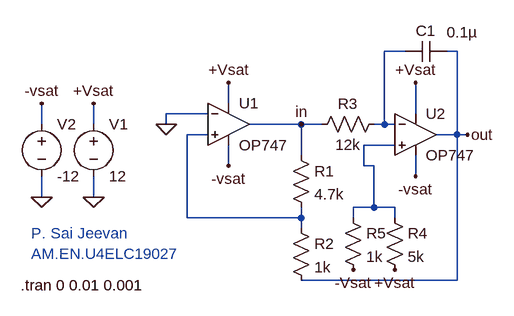
[diagram p0: schematic Sawtooth Waveform Generator.asc]
Sawtooth Waveform Generator.asc, the LTspice schematic file:
Version 4
SHEET 1 880 680
WIRE 352 32 320 32
WIRE 432 32 416 32
WIRE 80 112 80 80
WIRE 48 128 -16 128
WIRE 368 128 368 80
WIRE -208 144 -208 112
WIRE -128 144 -128 112
WIRE -16 144 -16 128
WIRE 192 144 112 144
WIRE 224 144 192 144
WIRE 320 144 320 32
WIRE 320 144 304 144
WIRE 336 144 320 144
WIRE 48 160 16 160
WIRE 432 160 432 32
WIRE 432 160 400 160
WIRE 448 160 432 160
WIRE 336 176 288 176
WIRE 192 192 192 144
WIRE 80 208 80 176
WIRE 288 208 288 176
WIRE 304 208 288 208
WIRE 368 224 368 192
WIRE -208 256 -208 224
WIRE -128 256 -128 224
WIRE 304 272 304 208
WIRE 304 272 272 272
WIRE 336 272 304 272
WIRE 16 288 16 160
WIRE 192 288 192 272
WIRE 192 288 16 288
WIRE 272 288 272 272
WIRE 336 288 336 272
WIRE 192 304 192 288
WIRE 432 384 432 160
WIRE 432 384 192 384
FLAG -16 144 0
FLAG 448 160 out
FLAG 80 80 +Vsat
FLAG 368 80 +Vsat
FLAG 368 224 -vsat
FLAG 80 208 -vsat
FLAG -128 256 0
FLAG -208 256 0
FLAG -128 112 +Vsat
FLAG -208 112 -vsat
FLAG 192 144 in
FLAG 336 368 +Vsat
FLAG 272 368 -Vsat
SYMBOL Opamps\\OP747 80 80 R0
SYMATTR InstName U1
SYMBOL Opamps\\OP747 368 96 R0
SYMATTR InstName U2
SYMBOL res 176 176 R0
SYMATTR InstName R1
SYMATTR Value 4.7k
SYMBOL res 176 288 R0
SYMATTR InstName R2
SYMATTR Value 1k
SYMBOL res 320 128 R90
WINDOW 0 0 56 VBottom 2
WINDOW 3 32 56 VTop 2
SYMATTR InstName R3
SYMATTR Value 12k
SYMBOL cap 416 16 R90
WINDOW 0 0 32 VBottom 2
WINDOW 3 -29 -24 VTop 2
SYMATTR InstName C1
SYMATTR Value 0.1µ
SYMBOL voltage -128 128 R0
WINDOW 123 0 0 Left 0
WINDOW 39 0 0 Left 0
SYMATTR InstName V1
SYMATTR Value 12
SYMBOL voltage -208 128 R0
WINDOW 123 0 0 Left 0
WINDOW 39 0 0 Left 0
SYMATTR InstName V2
SYMATTR Value -12
SYMBOL res 320 272 R0
SYMATTR InstName R4
SYMATTR Value 5k
SYMBOL res 256 272 R0
SYMATTR InstName R5
SYMATTR Value 1k
TEXT -240 392 Left 2 !.tran 0 0.01 0.001
TEXT -224 312 Left 2 ;P. Sai Jeevan\nAM.EN.U4ELC19027

The netlist it stands for:
* Sawtooth Waveform Generator.asc
XU1 N002 0 +Vsat -vsat in OP747  ; pins In+ In- V+ V- OUT
XU2 N003 N001 +Vsat -vsat out OP747  ; pins In+ In- V+ V- OUT
R1 in N002 4.7k
R2 N002 out 1k
R3 N001 in 12k
C1 out N001 0.1µ
V1 +Vsat 0 12
V2 -vsat 0 -12
R4 N003 +Vsat 5k
R5 N003 -vsat 1k
.tran 0 0.01 0.001
* P. Sai Jeevan
* AM.EN.U4ELC19027
.backanno
.end